# Altium schematic sheet new power management.SchDoc
size 431 x 279 mm; SheetNumber: 3; SheetTotal: 4
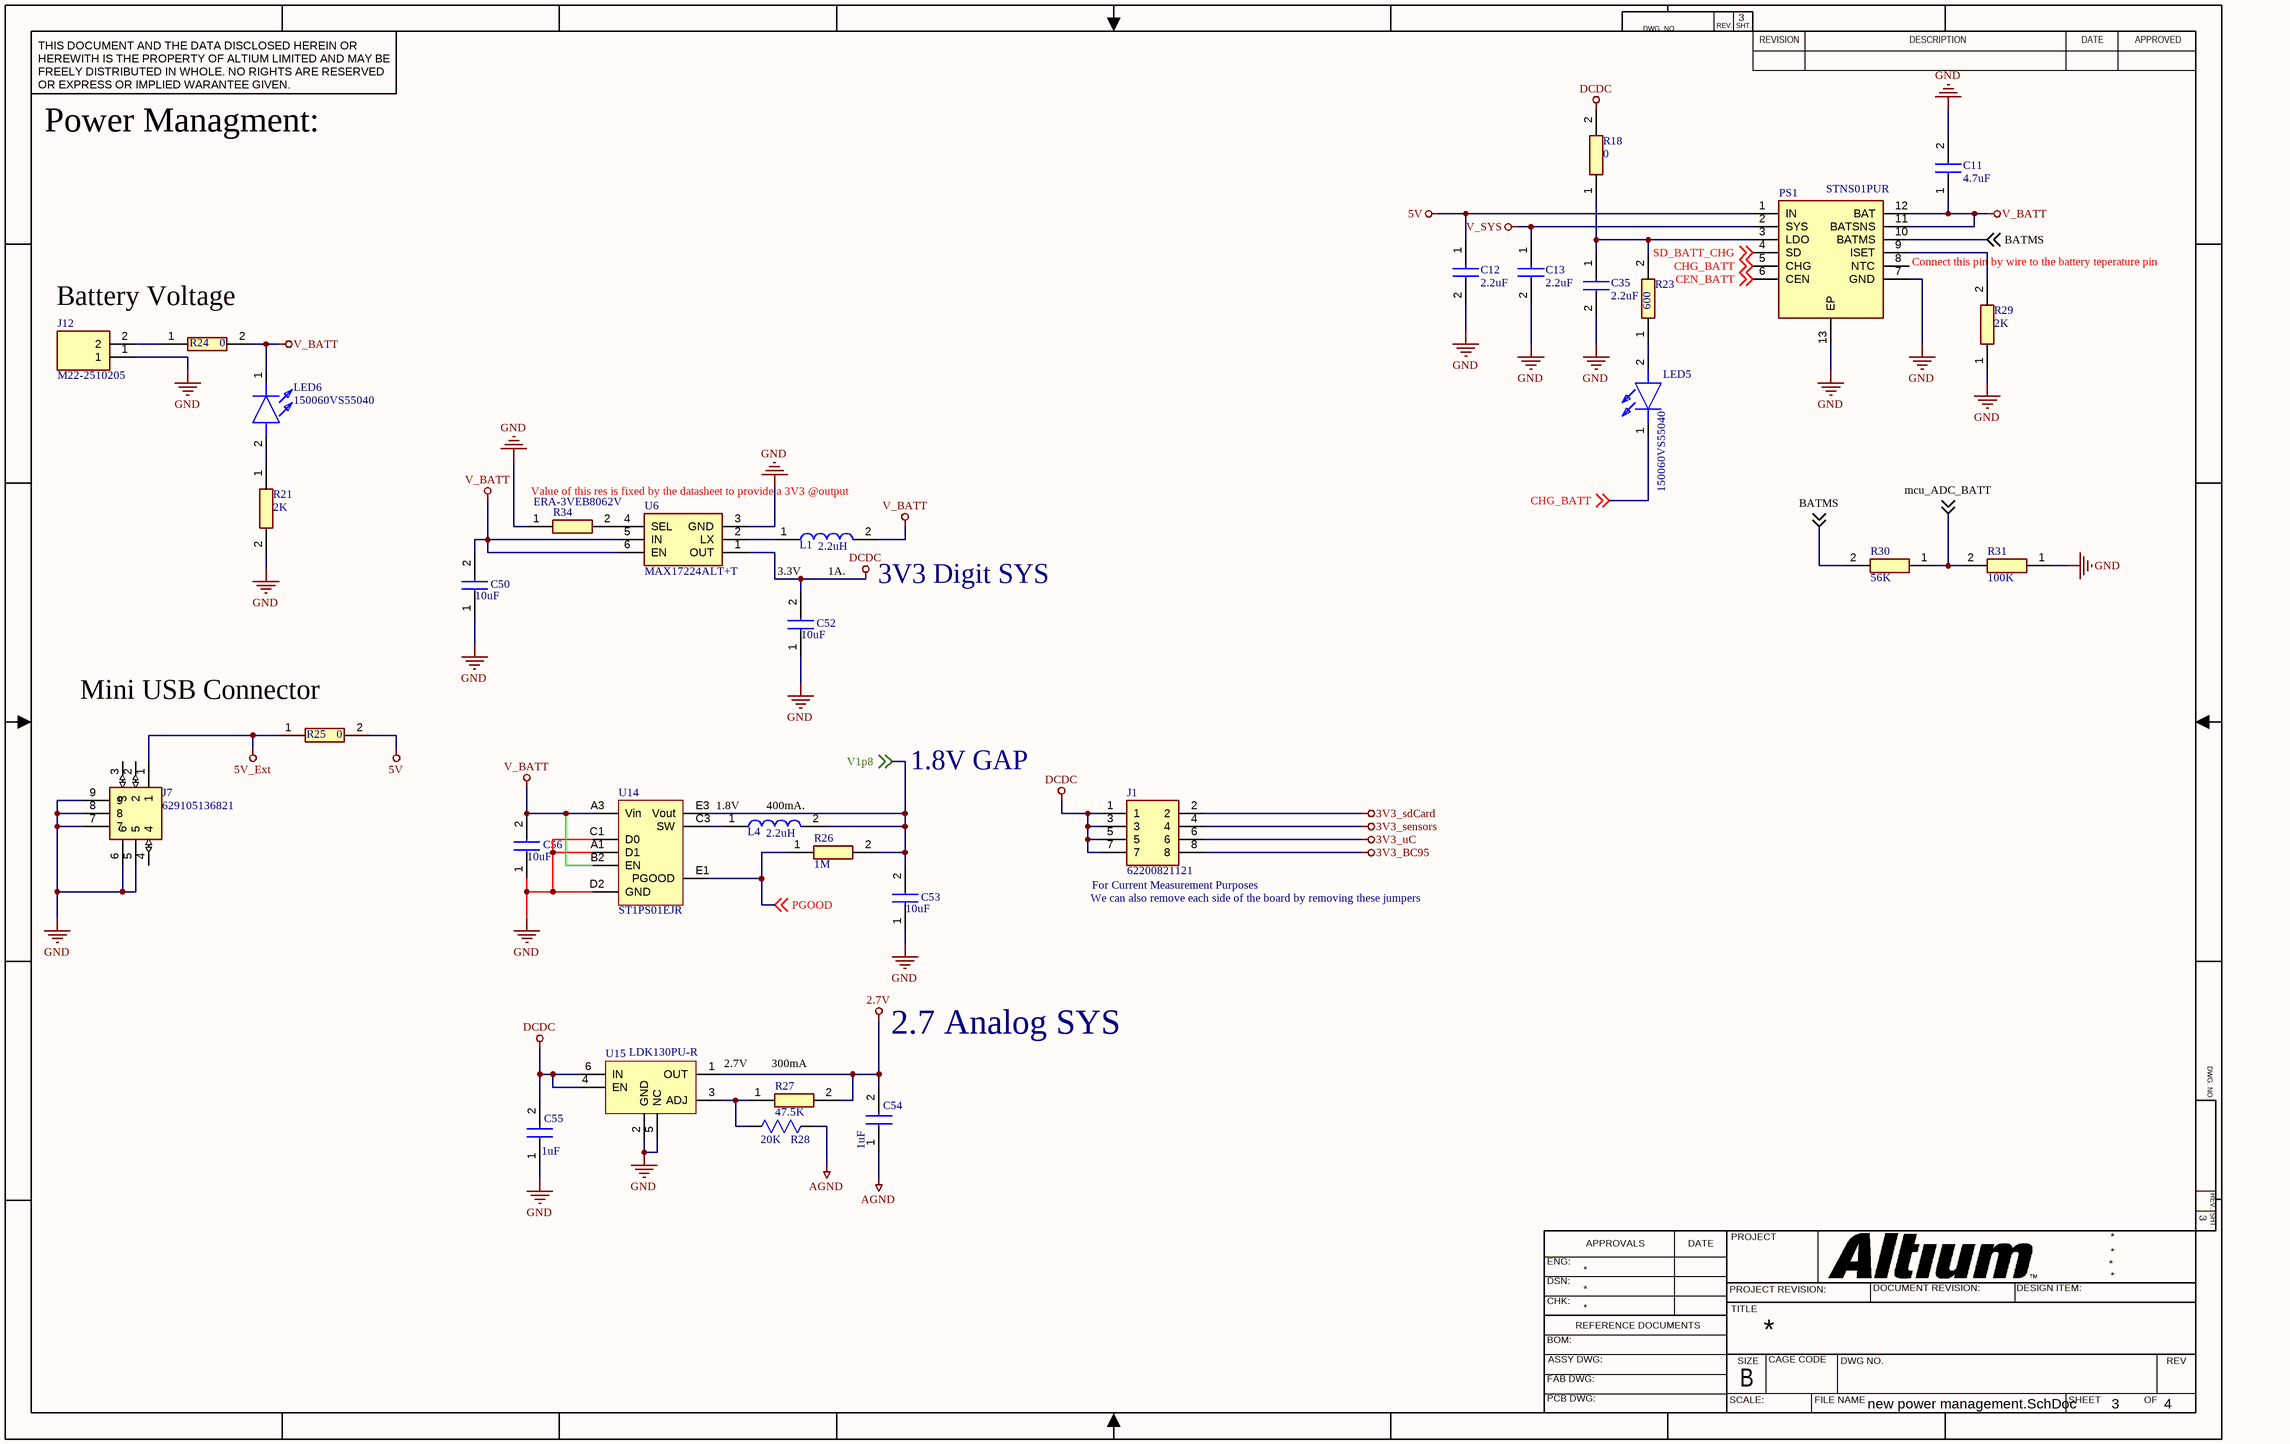
[diagram p0: new power management.SchDoc]

## Parts
C11  4.7uF  [CAPC1608X90N]
C12  2.2uF  [CAPC1608X90N]
C13  2.2uF  [CAPC1608X90N]
C35  2.2uF  [CAPC1608X90N]
C50  10uF  [CAPC1005X90N]
C52  10uF  [CAPC1005X90N]
C53  10uF  [CAPC1005X90N]
C54  1uF  [CAPC1005X55N]
C55  1uF  [CAPC1005X55N]
C56  10uF  [CAPC1005X90N]
J1  62200821121  [HDRV8W50P127_2X4_508X340X530P]
J7  629105136821  [MICRO-USB(2.0-SMT-TYPE-B)]
J12  M22-2510205  [HDRV2W60P0X200_1X2_400X200X525P]
L1  2.2uH  [INDC2520X100N]
L4  2.2uH  [INDC2520X100N]
LED5  150060VS55040  [LEDM168X50N]
LED6  150060VS55040  [LEDM168X50N]
PS1  STNS01PUR  [SON45P300X300X80-13N-D]
R18  0  [RESC1608X55N]
R21  2K  [RESC1005X35N]
R23  600  [RESC2012X60N]
R24  0  [RESC1608X55N]
R25  0  [RESC1608X55N]
R26  1M  [RESC1005X40N]
R27  47.5K  [RESC1005X40N]
R28  20K  [RESC1005X40N]
R29  2K  [RESC1608X55N]
R30  56K  [ERA3KV_(0603)]
R31  100K  [RESC1608X55N]
R34  ERA-3VEB8062V  [ERA3KV_(0603)]
U6  MAX17224ALT+T  [MAX17220ALT]
U14  ST1PS01EJR  [ST1PS01EJR]
U15  LDK130PU-R  [LDK130PU18R]

## Nets
2.7V: C54.2 R27.2 U15.1(OUT)
3V3_BC95: J1.8
3V3_sdCard: J1.2
3V3_sensors: J1.4
3V3_uC: J1.6
5V: C12.1 PS1.1(IN) R25.2
5V_Ext: J7.1 R25.1
AGND: C54.1 R28.1(R1)
DCDC: C52.2 C55.2 J1.1 J1.3 J1.5 J1.7 R18.2 U6.1(OUT) U15.4(EN) U15.6(IN)
GND: C11.2 C12.2 C13.2 C35.2 C50.1 C52.1 C53.1 C55.1 C56.1 J7.5 J7.6 J7.7 J7.8 J7.9 J12.1 PS1.7(GND) PS1.13(EP) R21.2 R29.1 R31.1 R34.1 U6.3(GND) U14.A1(D1) U14.C1(D0) U14.D2(GND) U15.2(GND) U15.5(NC)
V_BATT: C11.1 C50.2 C56.2 L1.2 LED6.1(K) PS1.11(BATSNS) PS1.12(BAT) R24.2 U6.5(IN) U6.6(EN) U14.A3(Vin) U14.B2(EN)
V_SYS: C13.1 PS1.2(SYS)
BATMS: PS1.10(BATMS) R30.2 ; off-sheet BATMS
CEN_BATT: PS1.6(CEN) ; off-sheet CEN_BATT
CHG_BATT: LED5.1(K) PS1.5(CHG) ; off-sheet CHG_BATT
mcu_ADC_BATT: R30.1 R31.2 ; off-sheet mcu_ADC_BATT
PGOOD: R26.1 U14.E1(PGOOD) ; off-sheet PGOOD
SD_BATT_CHG: PS1.4(SD) ; off-sheet SD_BATT_CHG
V1p8: C53.2 L4.2 R26.2 U14.E3(Vout) ; off-sheet V1p8
NetC35_1: C35.1 PS1.3(LDO) R18.1 R23.2
NetJ12_2: J12.2 R24.1
NetL1_1: L1.1 U6.2(LX)
NetL4_1: L4.1 U14.C3(SW)
NetLED5_2: LED5.2(A) R23.1
NetLED6_2: LED6.2(A) R21.1
NetPS1_9: PS1.9(ISET) R29.2
NetR27_1: R27.1 R28.2(R2) U15.3(ADJ)
NetR34_2: R34.2 U6.4(SEL)

Not connected (* = marked no-connect by the designer): J7 2 3 4; PS1 8(NTC)

## Notes on the sheet
- Power Managment:
- Connect this pin by wire to the battery teperature pin
- Battery Voltage
- Value of this res is fixed by the datasheet to provide a 3V3 @output
- 3.3V         1A.
- (near L1) 3V3 Digit SYS
- (near R25) Mini USB Connector
- (near L4) 1.8V         400mA.
- 1.8V GAP
- (near J1) We can also remove each side of the board by removing these jumpers
- (near J1) For Current Measurement Purposes
- 2.7V        300mA
- 2.7 Analog SYS
- DWG. NO.
- REV.
- SHT.
- THIS DOCUMENT AND THE DATA DISCLOSED HEREIN OR HEREWITH IS THE PROPERTY OF ALTIUM LIMITED AND MAY BE FREELY DISTRIBUTED IN WHOLE. NO RIGHTS ARE RESERVED OR EXPRESS OR IMPLIED WARANTEE GIVEN.
- REVISION
- DESCRIPTION
- DATE
- APPROVED
- ENG:
- APPROVALS
- PROJECT
- DSN:
- CHK:
- REFERENCE DOCUMENTS
- PROJECT REVISION:
- TITLE
- DOCUMENT REVISION:
- DESIGN ITEM:
- BOM:
- FAB DWG:
- PCB DWG:
- ASSY DWG:
- SCALE:
- SIZE
- B
- CAGE CODE
- FILE NAME
- DWG NO.
- SHEET
- OF
- REV

## Library data of the parts
C11 = LMK107BJ475KA-T: Capacitor; Manufacturer_Name: TAIYO YUDEN; Height: 0.9mm; Manufacturer_Part_Number: LMK107BJ475KA-T
C12 C13 C35 = GRM188R71A225KE15D: Capacitor; Manufacturer_Name: Murata Electronics; Datasheet Link: https://psearch.en.murata.com/capacitor/product/GRM188R71A225KE15%23.html; Height: 0.9mm; Manufacturer_Part_Number: GRM188R71A225KE15D
C50 C52 C53 C56 = CL05A106MP8NUB8: Capacitor; Manufacturer_Name: Samsung Electro-Mechanics; Datasheet Link: https://datasheet.datasheetarchive.com/originals/distributors/DKDS-19/372904.pdf; Height: 0.9mm; Manufacturer_Part_Number: CL05A106MP8NUB8
C54 C55 = JMK105BJ105KV-F: Capacitor; Manufacturer_Name: TAIYO YUDEN; Datasheet Link: https://datasheet.datasheetarchive.com/originals/distributors/Datasheets-DGA20/25674.pdf; Height: 0.55mm; Manufacturer_Part_Number: JMK105BJ105KV-F
J1 = 62200821121: Connector; Manufacturer_Name: Wurth Elektronik; Height: 5.3mm; Manufacturer_Part_Number: 62200821121
J7 = 629105136821: Connector; Manufacturer_Name: Wurth Elektronik; Datasheet Link: https://componentsearchengine.com/Datasheets/1/629105136821.pdf; Mouser2 Part Number: 710-629105136821; Mouser2 Price/Stock: https://www.mouser.com/Search/Refine.aspx?Keyword=710-629105136821; Manufacturer_Part_Number: 629105136821
J12 = M22-2510205: Connector; Manufacturer_Name: Harwin; Datasheet Link: https://cdn.harwin.com/pdfs/M22-251.pdf; Height: 5.25mm; Manufacturer_Part_Number: M22-2510205
L1 L4 = 74438323022: Inductor; Manufacturer_Name: Wurth Elektronik; Datasheet Link: https://componentsearchengine.com//74438323022.pdf; Height: 1mm; Mouser2 Part Number: 710-74438323022; Mouser2 Price/Stock: https://www.mouser.com/Search/Refine.aspx?Keyword=710-74438323022; Manufacturer_Part_Number: 74438323022
LED5 LED6 = 150060VS55040: LED; Manufacturer_Name: Wurth Elektronik; Datasheet Link: https://katalog.we-online.com/led/datasheet/150060VS55040.pdf; Height: 0.5mm; Manufacturer_Part_Number: 150060VS55040
PS1 = STNS01PUR: Power Supply; Manufacturer_Name: STMicroelectronics; Datasheet Link: https://componentsearchengine.com/Datasheets/2/STNS01PUR.pdf; Height: 0.8mm; Manufacturer_Part_Number: STNS01PUR
R18 R24 R25 = RC0603FR-070RL: Resistor; Manufacturer_Name: YAGEO (PHYCOMP); Height: 0.55mm; Manufacturer_Part_Number: RC0603FR-070RL
R21 = RT0402FRE072KL: Resistor; Manufacturer_Name: YAGEO (PHYCOMP); Datasheet Link: https://datasheet.datasheetarchive.com/originals/distributors/Datasheets_SAMA/a1f8f48f216d234b3e6a96d43a77a0c1.pdf; Height: 0.35mm; Manufacturer_Part_Number: RT0402FRE072KL
R23 = CRCW0805600RFKEAHP: Resistor; Manufacturer_Name: Vishay; Datasheet Link: https://componentsearchengine.com/Datasheets/1/CRCW08051R00FKEAHP.pdf; Height: 0.6mm; Manufacturer_Part_Number: CRCW0805600RFKEAHP
R26 = CRG0402F1M0: Resistor; Manufacturer_Name: TE Connectivity; Datasheet Link: https://datasheet.datasheetarchive.com/originals/distributors/DKDS-21/401698.pdf; Height: 0.4mm; Manufacturer_Part_Number: CRG0402F1M0
R27 = RC0402FR-0747K5L: Resistor; Manufacturer_Name: YAGEO (PHYCOMP); Datasheet Link: https://componentsearchengine.com//RC0402FR-0747K5L.pdf; Height: 0.4mm; Mouser2 Part Number: 603-RC0402FR-0747K5L; Mouser2 Price/Stock: https://www.mouser.com/Search/Refine.aspx?Keyword=603-RC0402FR-0747K5L; Manufacturer_Part_Number: RC0402FR-0747K5L
R28 = RC0402FR-0720KL: 20 kOhms Â±1% 0.063W, 1/16W Chip Resistor 0402 _1005 Metric_ Moisture Resistant Thick Film; MF: Yageo; MP: RC0402FR-0720KL; Package: 0402 Yageo; SnapEDA_Link: https://www.snapeda.com/parts/RC0402FR-0720KL/Yageo/view-part/614868/?ref=snap; Availability: Unavailable; Price: None; Value: *
R29 = CPF0603F2K0C1: Resistor; Manufacturer_Name: TE Connectivity; Height: 0.55mm; Manufacturer_Part_Number: CPF0603F2K0C1
R30 = ERA-3VRW5602V: Resistor; Manufacturer_Name: Panasonic; Datasheet Link: http://industrial.panasonic.com/cdbs/www-data/pdf/RDM0000/RDM0000C331.pdf; Height: 0.4mm; Manufacturer_Part_Number: ERA-3VRW5602V
R31 = CHV0603AFX-1003ELF: Resistor; Manufacturer_Name: Bourns; Datasheet Link: https://www.bourns.com/docs/product-datasheets/chv.pdf?sfvrsn=adcf1bf9_27; Height: 0.55mm; Manufacturer_Part_Number: CHV0603AFX-1003ELF
R34 = ERA-3VEB8062V: Resistor; Manufacturer_Name: Panasonic; Datasheet Link: http://industrial.panasonic.com/cdbs/www-data/pdf/RDM0000/RDM0000C331.pdf; Height: 0.4mm; Manufacturer_Part_Number: ERA-3VEB8062V
U6 = MAX17224ALT+T: Inductor; Manufacturer_Name: Maxim Integrated; Datasheet Link: https://datasheets.maximintegrated.com/en/ds/MAX17220-MAX17225.pdf; Height: 0.8mm; Manufacturer_Part_Number: MAX17224ALT+T
U14 = ST1PS01EJR: 400mA Nano-Quiescent Synchronous step-down converter with digital voltage select; Manufacturer: STMicroelectronics; Output Type: Fixed; Output Configuration: Positive; Number of Outputs: 1; Min Input Voltage: 1.8V; Max Input Voltage: 5.5V; Min Output Voltage: 3.3V; Switching Frequency: 2MHz; Synchronous Rectifier: Yes; Supplier 1: RSComponents; Supplier Part Number 1: 1924839; Manufacturer Part Number: ST1PS01EJR; RoHS: Yes; Category: Voltage Regulators - Switching; Stock 1: 500; Mount: Surface Mount; Min Operating Temperature: -40°C; Max Operating Temperature: 85°C; Packaging: Tape and Reel; Output Current: 400mA; RoHS Compliant: Yes; ComponentLink1URL: https://www.st.com/resource/en/datasheet/st1ps01.pdf?src-supplier=Digi-Key; ComponentLink1Description: https://www.st.com/resource/en/datasheet/st1ps01.pdf?src-supplier=Digi-Key
U15 = LDK130PU-R: Adjustable Positive LDO Regulator, 0.8V Min, 5.1V Max, 0.4V Dropout, PDSO6; Manufacturer: STMicroelectronics; Number of Outputs: 1; Min Input Voltage: 1.9V; Output Current: 300mA; Max Input Voltage: 5.5V; Dropout Voltage: 200mV; Output Voltage: 5.3V; Quiescent Current: 60uA; Min Output Voltage: 800mV; Accuracy: 2%; Operating Supply Current: 70uA; Power Supply Rejection Ratio (PSRR): 55dB; Supplier 1: Mouser; Supplier Part Number 1: 511-LDK130PU-R; Manufacturer Part Number: LDK130PU-R; RoHS: Yes; Category: Voltage Regulators - Linear; Stock 1: 232; Mount: Surface Mount; Case/Package: DFN; Number of Pins: 6; Min Operating Temperature: -40°C; Max Operating Temperature: 125°C; Packaging: Tape and Reel; Max Output Current: 300mA; Package Quantity: 3000; Number of Regulators: 1; Polarity: Positive; Output Voltage Accuracy: 2%; Tolerance: 2%; Output Type: Adjustable; Length: 1.3mm; Width: 1.2mm; Height: 0.45mm; Radiation Hardening: No; REACH SVHC: No SVHC; Lead Free: Lead Free; RoHS Compliant: Yes; ComponentLink1URL: https://datasheet.ciiva.com/30007/dm00076097-30007047.pdf?src-supplier=Avnet; ComponentLink1Description: https://datasheet.ciiva.com/30007/dm00076097-30007047.pdf?src-supplier=Avnet; ComponentLink2URL: https://datasheet.ciiva.com/29568/dm00076097-29568344.pdf?src-supplier=Digi-Key; ComponentLink2Description: https://datasheet.ciiva.com/29568/dm00076097-29568344.pdf?src-supplier=Digi-Key; ComponentLink3URL: https://datasheet.ciiva.com/29568/dm00076097-29568345.pdf?src-supplier=Digi-Key; ComponentLink3Description: https://datasheet.ciiva.com/29568/dm00076097-29568345.pdf?src-supplier=Digi-Key; ComponentLink4URL: https://datasheet.ciiva.com/29568/dm00076097-29568346.pdf?src-supplier=Digi-Key; ComponentLink4Description: https://datasheet.ciiva.com/29568/dm00076097-29568346.pdf?src-supplier=Digi-Key